# Altium schematic sheet power.SchDoc
size A
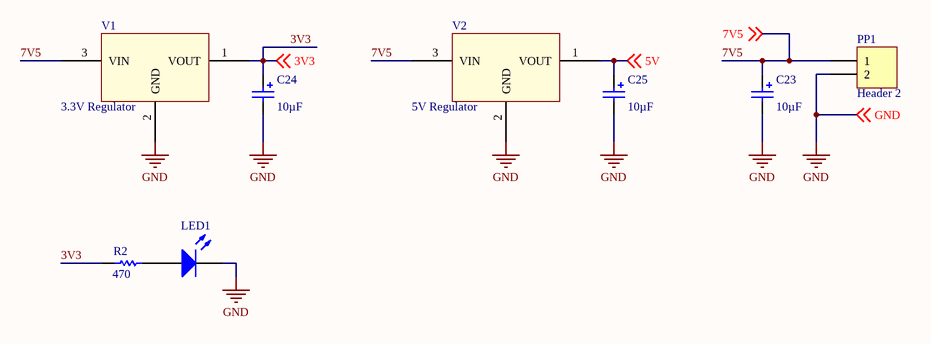
[diagram p0: power.SchDoc]

## Parts
C23  value 10µF  [0805-TC]  (hidden comment: Cap Pol1)
C24  value 10µF  [0805-TC]  (hidden comment: Cap Pol1)
C25  value 10µF  [0805-TC]  (hidden comment: Cap Pol1)
LED1  LED2  [0805-LED]  (value not drawn)
PP1  Header 2  [HDR1X2]
R2  value 470  [0805-R]  (hidden comment: Res1)
V1  3.3V Regulator  [SOT230P700X180-4N]
V2  5V Regulator  [SOT230P700X180-4N]

## Nets
GND: C23.2 C24.2 C25.2 LED1.2(K) PP1.2 V1.2(GND) V2.2(GND) ; off-sheet GND
3V3: C24.1 R2.1 V1.1(VOUT) ; off-sheet 3V3
5V: C25.1 V2.1(VOUT) ; off-sheet 5V
7V5: C23.1 PP1.1 V1.3(VIN) V2.3(VIN) ; off-sheet 7V5
NetLED1_1: LED1.1(A) R2.2

## Library data of the parts
C23-C25 = Cap Pol1: Polarized Capacitor (Radial); Published: 8-Jun-2000; LatestRevisionDate: 17-Jul-2002; LatestRevisionNote: Re-released for DXP Platform.; PackageReference: RB7.6-15; Publisher: Altium Limited; PackageDescription: Polarized Capacitor (Radial); 2 Leads
LED1 = LED2: Typical RED, GREEN, YELLOW, AMBER GaAs LED; Published: 8-Jun-2000; LatestRevisionDate: 17-Jul-2002; LatestRevisionNote: Re-released for DXP Platform.; PackageVersion: Feb-2002; PackageReference: 3.2X1.6X1.1; Publisher: Altium Limited; PackageDescription: SM LED; 2 Flat Leads
PP1 = Header 2: Header, 2-Pin; LatestRevisionDate: 17-Jul-2002; LatestRevisionNote: Re-released for DXP Platform.; Publisher: Altium Limited
R2 = Res1: Resistor; Published: 8-Jun-2000; LatestRevisionDate: 17-Jul-2002; LatestRevisionNote: Re-released for DXP Platform.; PackageReference: AXIAL-0.3; Publisher: Altium Limited; PackageDescription: Axial Device, Thru-Hole; 2 Leads; 0.3 in Pin Spacing
V1 V2 = NCP1117